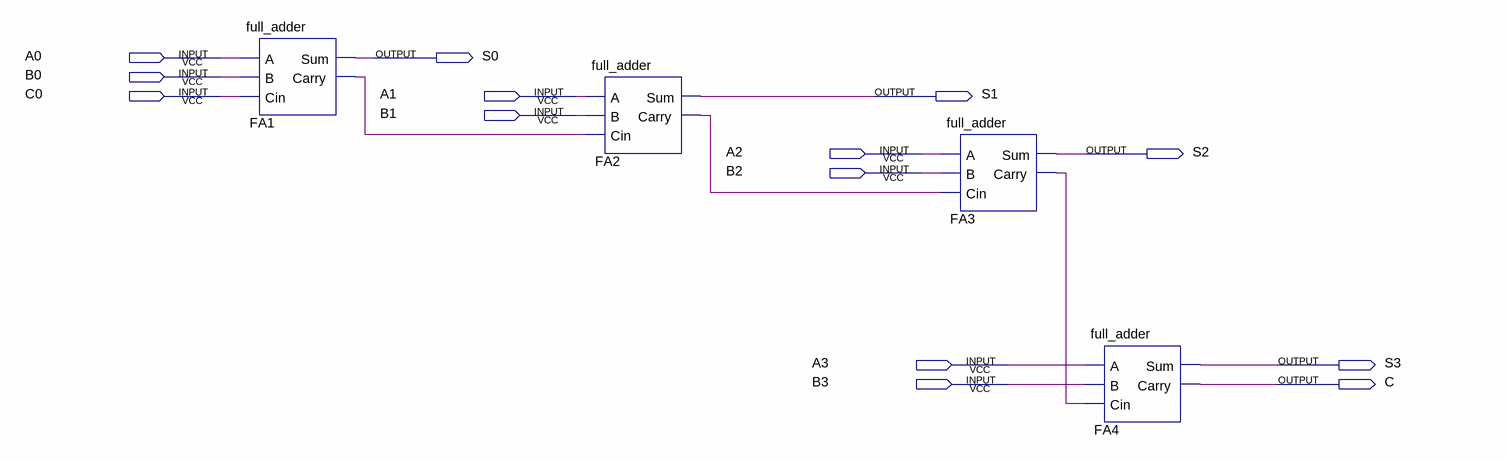
[diagram p0: schematic sheet]
// Quartus schematic Adder_Diagram.bdf as structural Verilog: 4 symbols, 14 pins
module Adder_Diagram (
  input  A0,
  input  B0,
  input  C0,
  input  A1,
  input  B1,
  input  A2,
  input  B2,
  input  A3,
  input  B3,
  output S0,
  output S1,
  output S2,
  output S3,
  output C
);

  wire FA1_carry, FA2_carry, FA3_carry;

  full_adder FA1 (.A(A0), .B(B0), .Cin(C0), .Sum(S0), .Carry(FA1_carry));
  full_adder FA2 (.A(A1), .B(B1), .Cin(FA1_carry), .Sum(S1), .Carry(FA2_carry));
  full_adder FA3 (.A(A2), .B(B2), .Cin(FA2_carry), .Sum(S2), .Carry(FA3_carry));
  full_adder FA4 (.A(A3), .B(B3), .Cin(FA3_carry), .Sum(S3), .Carry(C));
endmodule
